# EasyEDA Pro project HNDX.eprj, schematic Schematic3
Board Name: eeprom; Create Date: 2024-12-12; Page Name: P1; Project Name: GP; Schematic Name: Schematic3; Update Date: 2025-01-28; Company: 嘉立创EDA; Page Size: A4; Version: V1.0
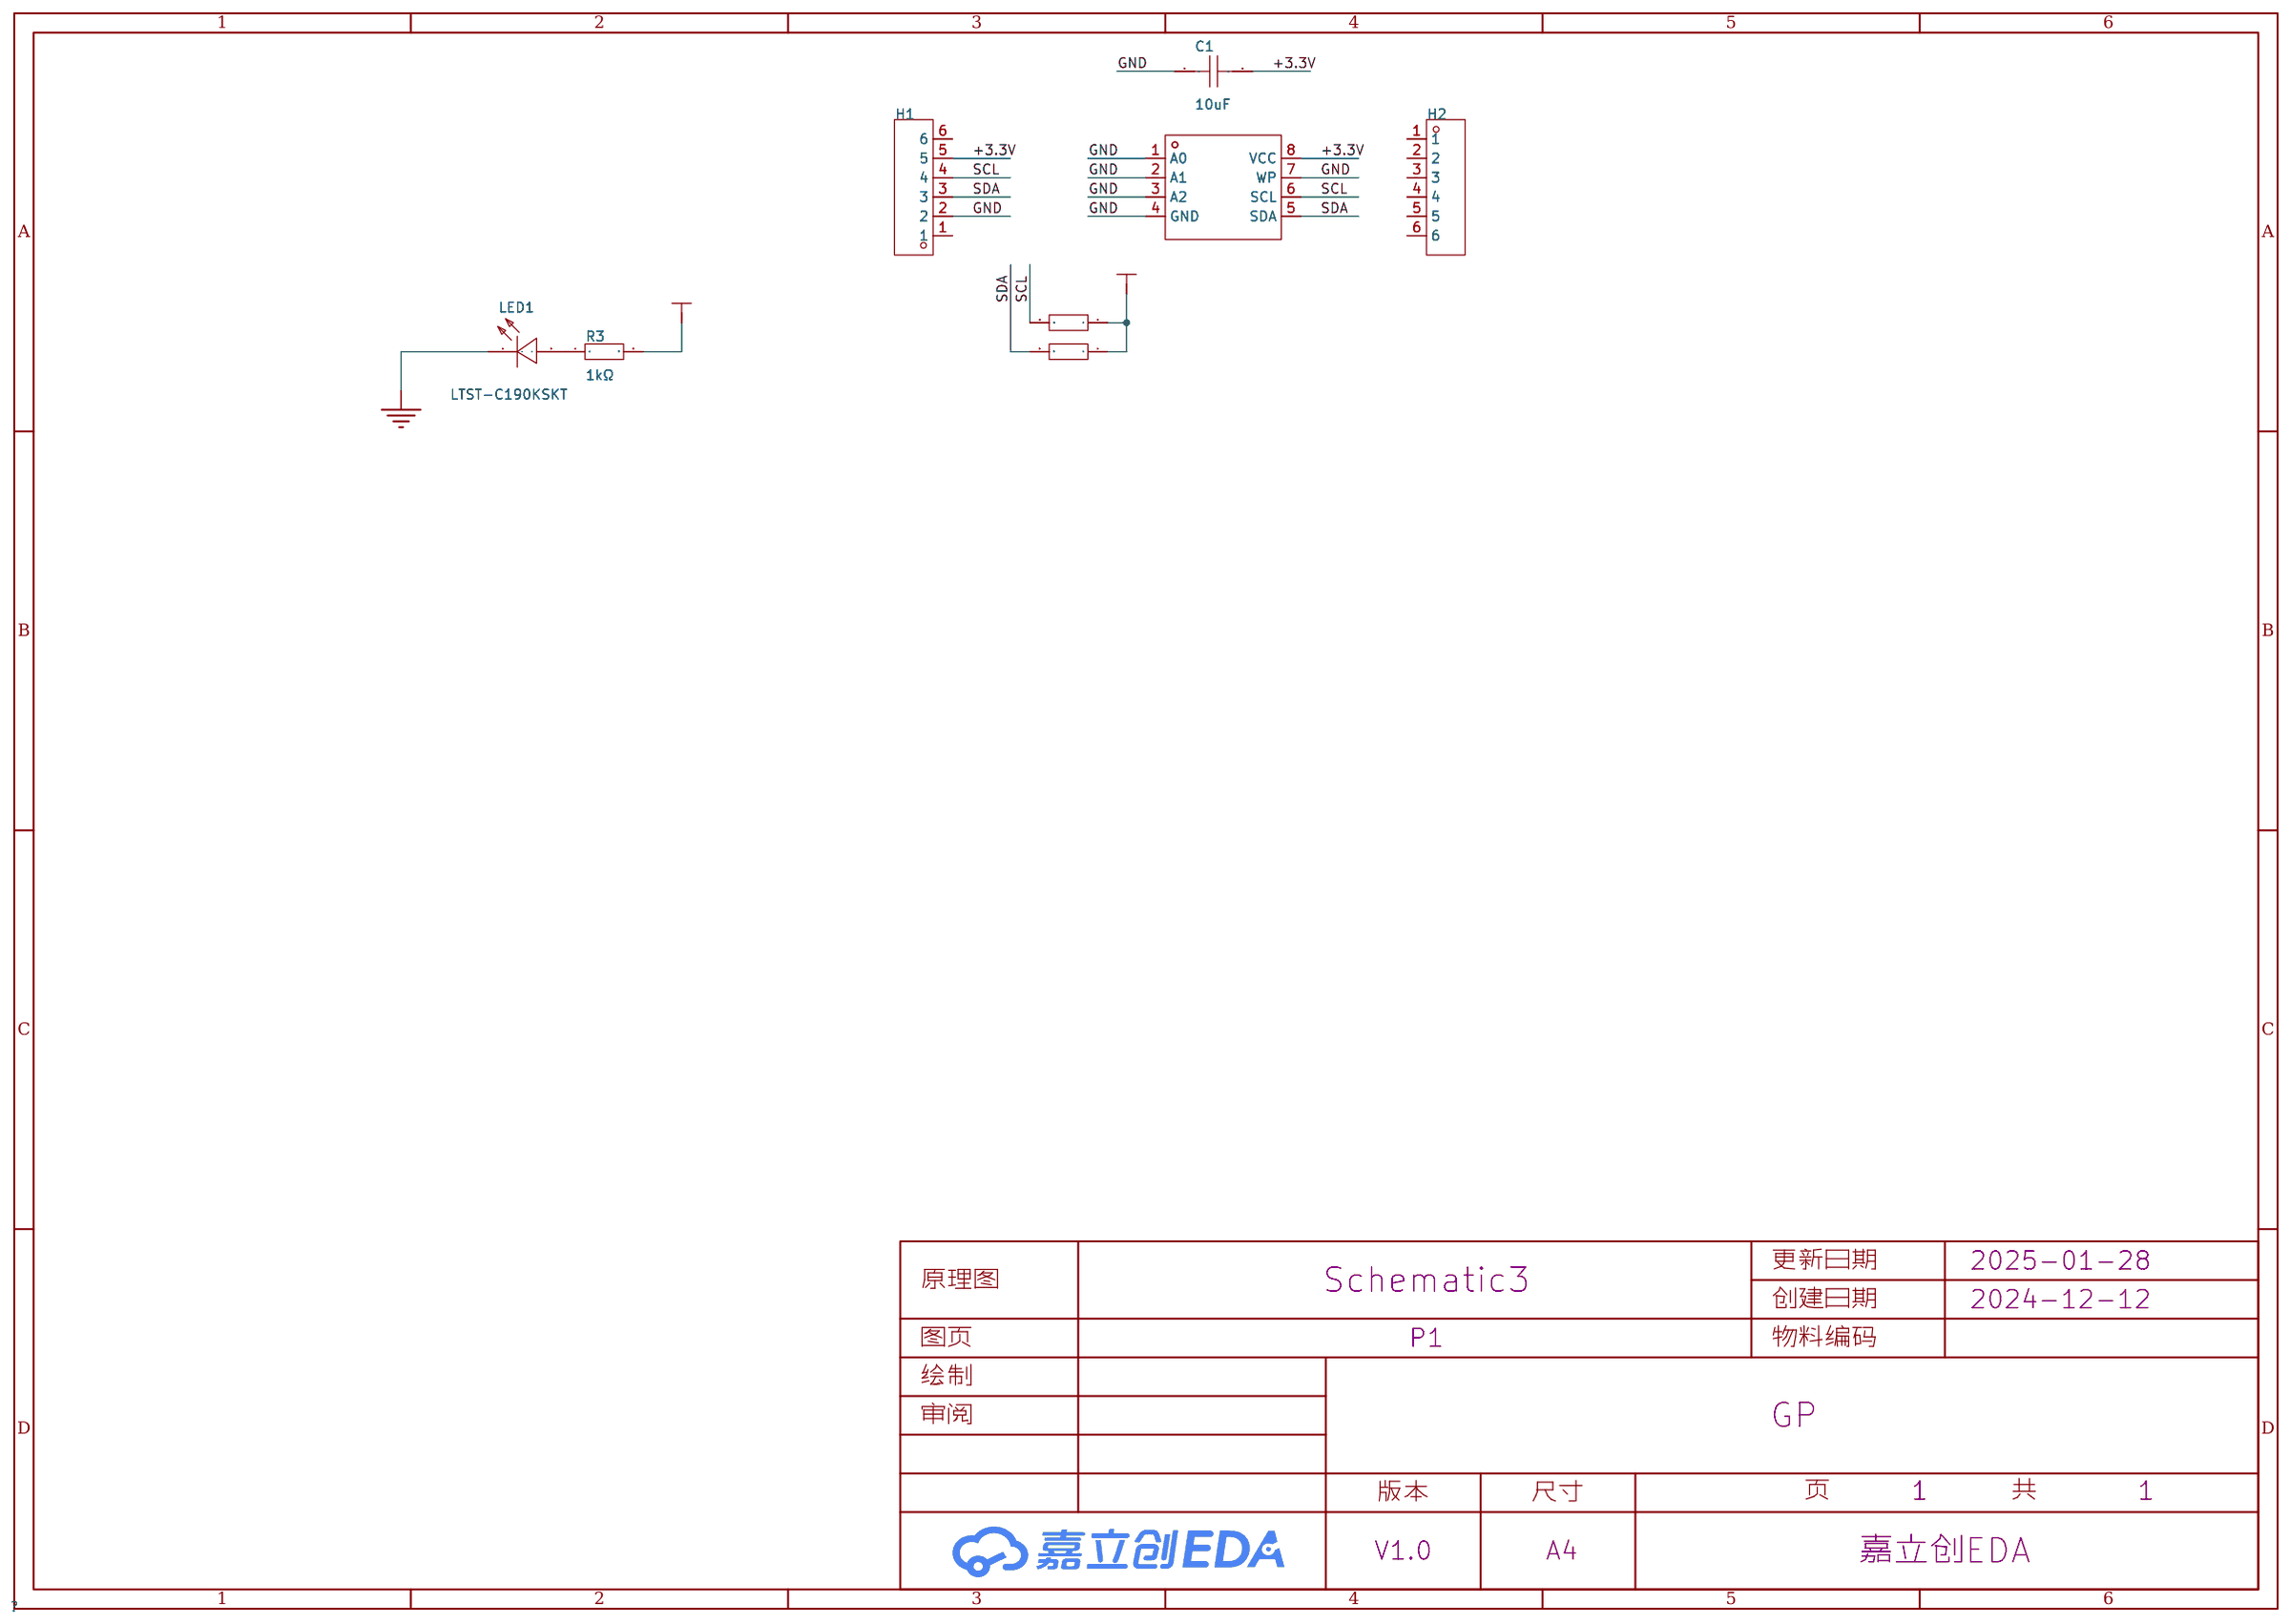
[diagram p2: schematic sheet]

## Parts
C1  10uF  [C1206]
H1  -  [HDR-TH_6P-P2.54-V-M]
H2  -  [HDR-TH_6P-P2.54-V-M]
LED1  LTST-C190KSKT  [LED0603-RD]
R1  1kΩ  [R0603]
R2  1kΩ  [R0603]
R3  1kΩ  [R0603]
U1  AT24C256C-SSHL-T  [SOIC-8_L4.9-W3.9-P1.27-LS6.0-BL]

## Library data of the parts
C1 = HGC1206R5106K500NSPJ: LCSC Part Name: 10uF ±10% 50V; Supplier Part: C7432781; Manufacturer: Chinocera(华瓷); Supplier Footprint: 1206; JLCPCB Part Class: 扩展库; Datasheet: https://atta.szlcsc.com/upload/public/pdf/source/20240320/FAC3FEC40A78BC5CCCE96C232A94D860.pdf; Supplier: LCSC; Tolerance: ±10%; Voltage Rated: 50V; Temperature Coefficient: X5R
H1 H2 = PZ254V-11-06P: 排数:单排;总PIN位数:6;间距:2.54mm;插针结构:1x6P;行距:-;安装类型:直插;圆针/方针:方针;额定电流:-;额定电压:-;配合针长度:6mm;塑高:2.5mm;端接针长度:3mm;触头材质:黄铜;触头镀层:-;工作温度范围:-40℃~+105℃;颜色:黑色;; LCSC Part Name: 2.54mm1x6P直插方针; Supplier Part: C492405; Manufacturer: XFCN(兴飞); Supplier Footprint: 插件,P=2.54mm; JLCPCB Part Class: ExtendedPart; Datasheet: https://atta.szlcsc.com/upload/public/pdf/source/20200309/C492405_597F1930F5B55CC3C7FD95458F1C3977.pdf; Supplier: LCSC; Number of Rows: 单排; Number of Pins: 6; Pitch: 2.54mm; Pin Structure: 1x6P; Mounting Type: 直插; Circluar Pins/Square Pins: 方针; Length of Mating Pin: 6mm; Insulation Height: 2.5mm; Length of End Connection Pin: 3mm; Contact Material: 黄铜; Operating Temperature Range: -40℃~+105℃; Color: 黑色
LED1 = LTST-C190KSKT: LCSC Part Name: 黄灯; Supplier Part: C125095; Manufacturer: LITEON(光宝); Supplier Footprint: 0603; JLCPCB Part Class: 扩展库; Datasheet: https://atta.szlcsc.com/upload/public/pdf/source/20180129/C125095_15171881843821315881.pdf; Supplier: LCSC; Emitted Color: 黄色; Forward Voltage (VF): 2.1V; Power Dissipation: 75mW; Forward Current: 20mA; Dominant Wavelength: 584.5nm~597nm; Peak Wavelength: 588nm; Lens Color: 无色透明透镜; Luminous Intensity: 104mcd; Viewing Angle: 130°; Operating Temperature: -30℃~+85℃
R1-R3 = 0603WAF1001T5E: 电阻类型:厚膜电阻;阻值:1kΩ;精度:±1%;功率:100mW;最大工作电压:75V;温度系数:±100ppm/℃;; LCSC Part Name: 1kΩ ±1% 100mW 厚膜电阻; Supplier Part: C21190; Manufacturer: UNI-ROYAL(厚声); Supplier Footprint: 0603; JLCPCB Part Class: 基础库; Datasheet: https://atta.szlcsc.com/upload/public/pdf/source/20200306/C422600_1E6D84923E4A46A82E41ADD87F860B5C.pdf; Supplier: LCSC; Type: 厚膜电阻; Tolerance: ±1%; Power(Watts): 100mW; Overload Voltage (Max): 75V; Temperature Coefficient: ±100ppm/℃; Operating Temperature Range: -55℃~+155℃
U1 = AT24C256C-SSHL-T: Supplier Part: C6482; Manufacturer: MICROCHIP(美国微芯); Supplier Footprint: SOIC-8; JLCPCB Part Class: 扩展库; Datasheet: https://atta.szlcsc.com/upload/public/pdf/source/20140704/1457707098744.pdf; Supplier: LCSC; Interface Type: I2C; Memory Size: 256Kbit; Supply Voltage: 1.7V~5.5V; Operating Temperature: -40℃~+85℃

## Nets
+3.3V: C1.2 H1.5 R1.1 R2.1 R3.2 U1.8(VCC)
GND: C1.1 H1.2 LED1.1(-) U1.1(A0) U1.2(A1) U1.3(A2) U1.4(GND) U1.7(WP)
SCL: H1.4 R1.2 U1.6(SCL)
SDA: H1.3 R2.2 U1.5(SDA)
$1N1146: LED1.2(+) R3.1

Not connected (* = marked no-connect by the designer): H1 1 6; H2 1 2 3 4 5 6
